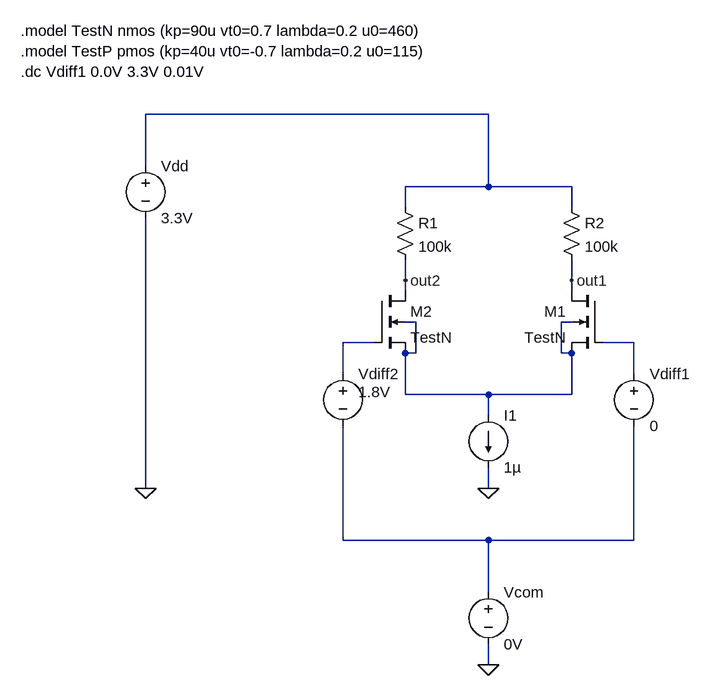
[diagram p0: schematic simple.asc]
simple.asc, the LTspice schematic file:
Version 4
SHEET 1 880 1668
WIRE 32 800 -496 800
WIRE -496 880 -496 800
WIRE 32 912 32 800
WIRE 32 912 -96 912
WIRE 160 912 32 912
WIRE -96 944 -96 912
WIRE 160 944 160 912
WIRE -96 1056 -96 1024
WIRE 160 1056 160 1024
WIRE -96 1072 -96 1056
WIRE 160 1072 160 1056
WIRE -80 1120 -96 1120
WIRE 160 1120 144 1120
WIRE -144 1152 -192 1152
WIRE 256 1152 208 1152
WIRE -80 1168 -80 1120
WIRE -80 1168 -96 1168
WIRE 144 1168 144 1120
WIRE 160 1168 144 1168
WIRE -192 1200 -192 1152
WIRE 256 1200 256 1152
WIRE -96 1232 -96 1168
WIRE 32 1232 -96 1232
WIRE 160 1232 160 1168
WIRE 160 1232 32 1232
WIRE 32 1264 32 1232
WIRE -496 1376 -496 960
WIRE 32 1376 32 1344
WIRE -192 1456 -192 1280
WIRE 32 1456 -192 1456
WIRE 256 1456 256 1280
WIRE 256 1456 32 1456
WIRE 32 1536 32 1456
WIRE 32 1648 32 1616
FLAG -496 1376 0
FLAG 32 1376 0
FLAG 32 1648 0
FLAG 160 1056 out1
FLAG -96 1056 out2
SYMBOL voltage -496 864 R0
WINDOW 123 0 0 Left 2
WINDOW 39 0 0 Left 2
SYMATTR InstName Vdd
SYMATTR Value 3.3V
SYMBOL nmos4 -144 1072 R0
SYMATTR InstName M2
SYMATTR Value TestN
SYMATTR Value2 l=100u w=100u
SYMBOL nmos4 208 1072 M0
SYMATTR InstName M1
SYMATTR Value TestN
SYMATTR Value2 l=100u w=100u
SYMBOL res -112 928 R0
SYMATTR InstName R1
SYMATTR Value 100k
SYMBOL res 144 928 R0
SYMATTR InstName R2
SYMATTR Value 100k
SYMBOL current 32 1264 R0
WINDOW 123 0 0 Left 2
WINDOW 39 0 0 Left 2
SYMATTR InstName I1
SYMATTR Value 1µ
SYMBOL voltage 32 1520 R0
WINDOW 123 0 0 Left 2
WINDOW 39 0 0 Left 2
SYMATTR InstName Vcom
SYMATTR Value 0V
SYMBOL voltage -192 1184 R0
WINDOW 3 24 44 Left 2
WINDOW 123 0 0 Left 2
WINDOW 39 0 0 Left 2
SYMATTR Value 1.8V
SYMATTR InstName Vdiff2
SYMBOL voltage 256 1184 R0
SYMATTR InstName Vdiff1
SYMATTR Value 0
TEXT -688 672 Left 2 !.model TestN nmos (kp=90u vt0=0.7 lambda=0.2 u0=460)\n.model TestP pmos (kp=40u vt0=-0.7 lambda=0.2 u0=115)\n.dc Vdiff1 0.0V 3.3V 0.01V

The netlist it stands for:
* simple.asc
Vdd N001 0 3.3V
M2 out2 N003 N002 N002 TestN l=100u w=100u
M1 out1 N004 N002 N002 TestN l=100u w=100u
R1 N001 out2 100k
R2 N001 out1 100k
I1 N002 0 1µ
Vcom N005 0 0V
Vdiff2 N003 N005 1.8V
Vdiff1 N004 N005 0
.model NMOS NMOS
.model PMOS PMOS
.lib standard.mos
.model TestN nmos (kp=90u vt0=0.7 lambda=0.2 u0=460)
.model TestP pmos (kp=40u vt0=-0.7 lambda=0.2 u0=115)
.dc Vdiff1 0.0V 3.3V 0.01V
.backanno
.end